# EAGLE schematic 7805 (EAGLE 7.5.0)
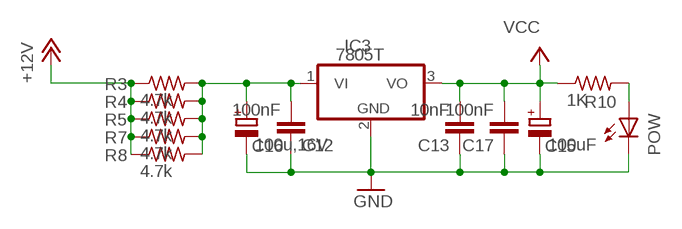
[diagram p0: schematic, sheet 1]

## Parts
C12  100nF  C-EU050-024X044  [C050-024X044]
C13  10nF  C-EU050-024X044  [C050-024X044]
C15  100uF  CPOL-EUTT2D6  [TT2D6]
C16  100u,16V  CPOL-EUTT2D6  [TT2D6]
C17  100nF  C-EU050-024X044  [C050-024X044]
IC3  7805T  [TO220H]
POW  LED3MM  [LED3MM]
R3  4.7k  R-US_0204/7  [0204/7]
R4  4.7k  R-US_0204/7  [0204/7]
R5  4.7k  R-US_0204/7  [0204/7]
R7  4.7k  R-US_0204/7  [0204/7]
R8  4.7k  R-US_0204/7  [0204/7]
R10  1K  R-US_0204/7  [0204/7]

## Nets
+12V: R3.1 R4.1 R5.1 R7.1 R8.1
GND: C12.1 C13.1 C15.- C16.- C17.1 IC3.2(GND) POW.K(C)
N$1: C12.2 C16.+ IC3.1(VI) R3.2 R4.2 R5.2 R7.2 R8.2
N$2: POW.A R10.2
VCC: C13.2 C15.+ C17.2 IC3.3(VO) R10.1

## Library data of the parts
C12 C13 C17 = rcl:C-EU: CAPACITOR, European symbol
C15 C16 = rcl:CPOL-EU: POLARIZED CAPACITOR, European symbol
IC3 = linear:78*: Positive VOLTAGE REGULATOR Source: http://cache.national.com/ds/LM/LM78L05.pdf http://www.fairchildsemi.com/ds/LM/LM7805.pdf
POW = led:LED: LED OSRAM: - CHIPLED LG R971, LG N971, LY N971, LG Q971, LY Q971, LO R971, LY R971 LH N974, LH R974 LS Q976, LO Q976, LY Q976 LO Q996 - Hyper CHIPLED LW Q18S LB Q993, LB Q99A, LB R99A - SideLED LS A670, LO A670, LY A670, LG A670, LP A670 LB A673, LV A673, LT A673, LW A673 LH A674 LY A675 LS A676, LA A676, LO A676, LY A676, LW A676 LS A679, LY A679, LG A679 - Hyper Micro SIDELED® LS Y876, LA Y876, LO Y876, LY Y876 LT Y87S - SmartLED LW L88C, LW L88S LB L89C, LB L89S, LG L890 LS L89K, LO L89K, LY L89K LS L896, LA L896, LO L896, LY L896 - TOPLED LS T670, LO T670, LY T670, LG T670, LP T670 LSG T670, LSP T670, LSY T670, LOP T670, LYG T670 LG T671, LOG T671, LSG T671 LB T673, LV T673, LT T673, LW T673 LH T674 LS T676, LA T676, LO T676, LY T676, LB T676, LH T676, LSB T676, LW T676 LB T67C, LV T67C, LT T67C, LS T67K, LO T67K, LY T67K, LW E67C LS E67B, LA E67B, LO E67B, LY E67B, LB E67C, LV E67C, LT E67C LW T67C LS T679, LY T679, LG T679 LS T770, LO T770, LY T770, LG T770, LP T770 LB T773, LV T773, LT T773, LW T773 LH T774 LS E675, LA E675, LY E675, LS T675 LS T776, LA T776, LO T776, LY T776, LB T776 LHGB T686 LT T68C, LB T68C - Hyper Mini TOPLED® LB M676 - Mini TOPLED Santana® LG M470 LS M47K, LO M47K, LY M47K Source: http://www.osram.convergy.de LUXEON: - LUMILED® LXK2-PW12-R00, LXK2-PW12-S00, LXK2-PW14-U00, LXK2-PW14-V00 LXK2-PM12-R00, LXK2-PM12-S00, LXK2-PM14-U00 LXK2-PE12-Q00, LXK2-PE12-R00, LXK2-PE12-S00, LXK2-PE14-T00, LXK2-PE14-U00 LXK2-PB12-K00, LXK2-PB12-L00, LXK2-PB12-M00, LXK2-PB14-N00, LXK2-PB14-P00, LXK2-PB14-Q00 LXK2-PR12-L00, LXK2-PR12-M00, LXK2-PR14-Q00, LXK2-PR14-R00 LXK2-PD12-Q00, LXK2-PD12-R00, LXK2-PD12-S00 LXK2-PH12-R00, LXK2-PH12-S00 LXK2-PL12-P00, LXK2-PL12-Q00, LXK2-PL12-R00 Source: www.luxeon.com KINGBRIGHT: KA-3528ASYC Source: www.kingbright.com
R3-R5 R7 R8 R10 = adafruit:R-US_: RESISTOR, American symbol